# Altium schematic sheet IPMC_MACP 1.SchDoc
size A2
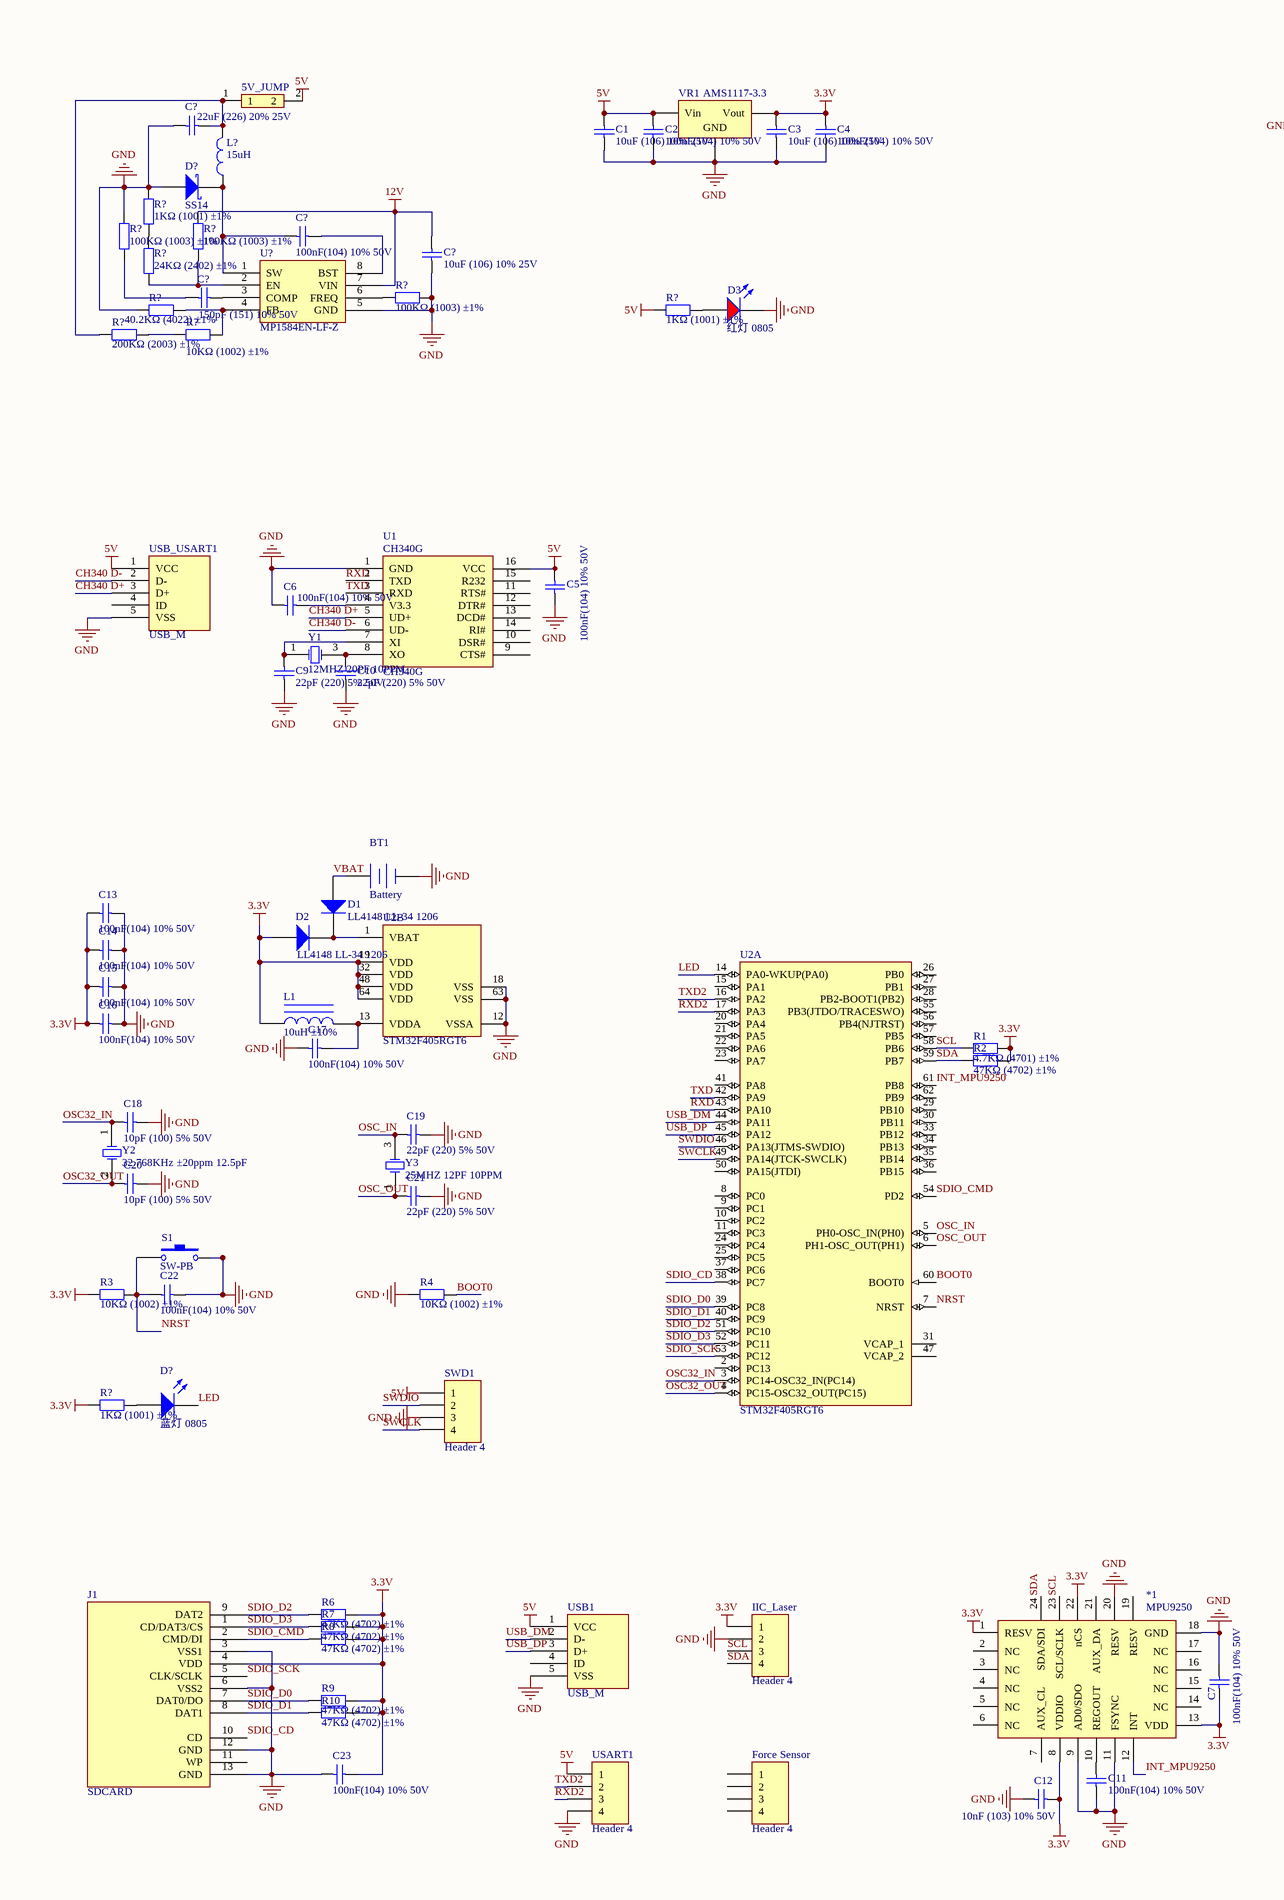
[diagram p0: IPMC_MACP 1.SchDoc, left]
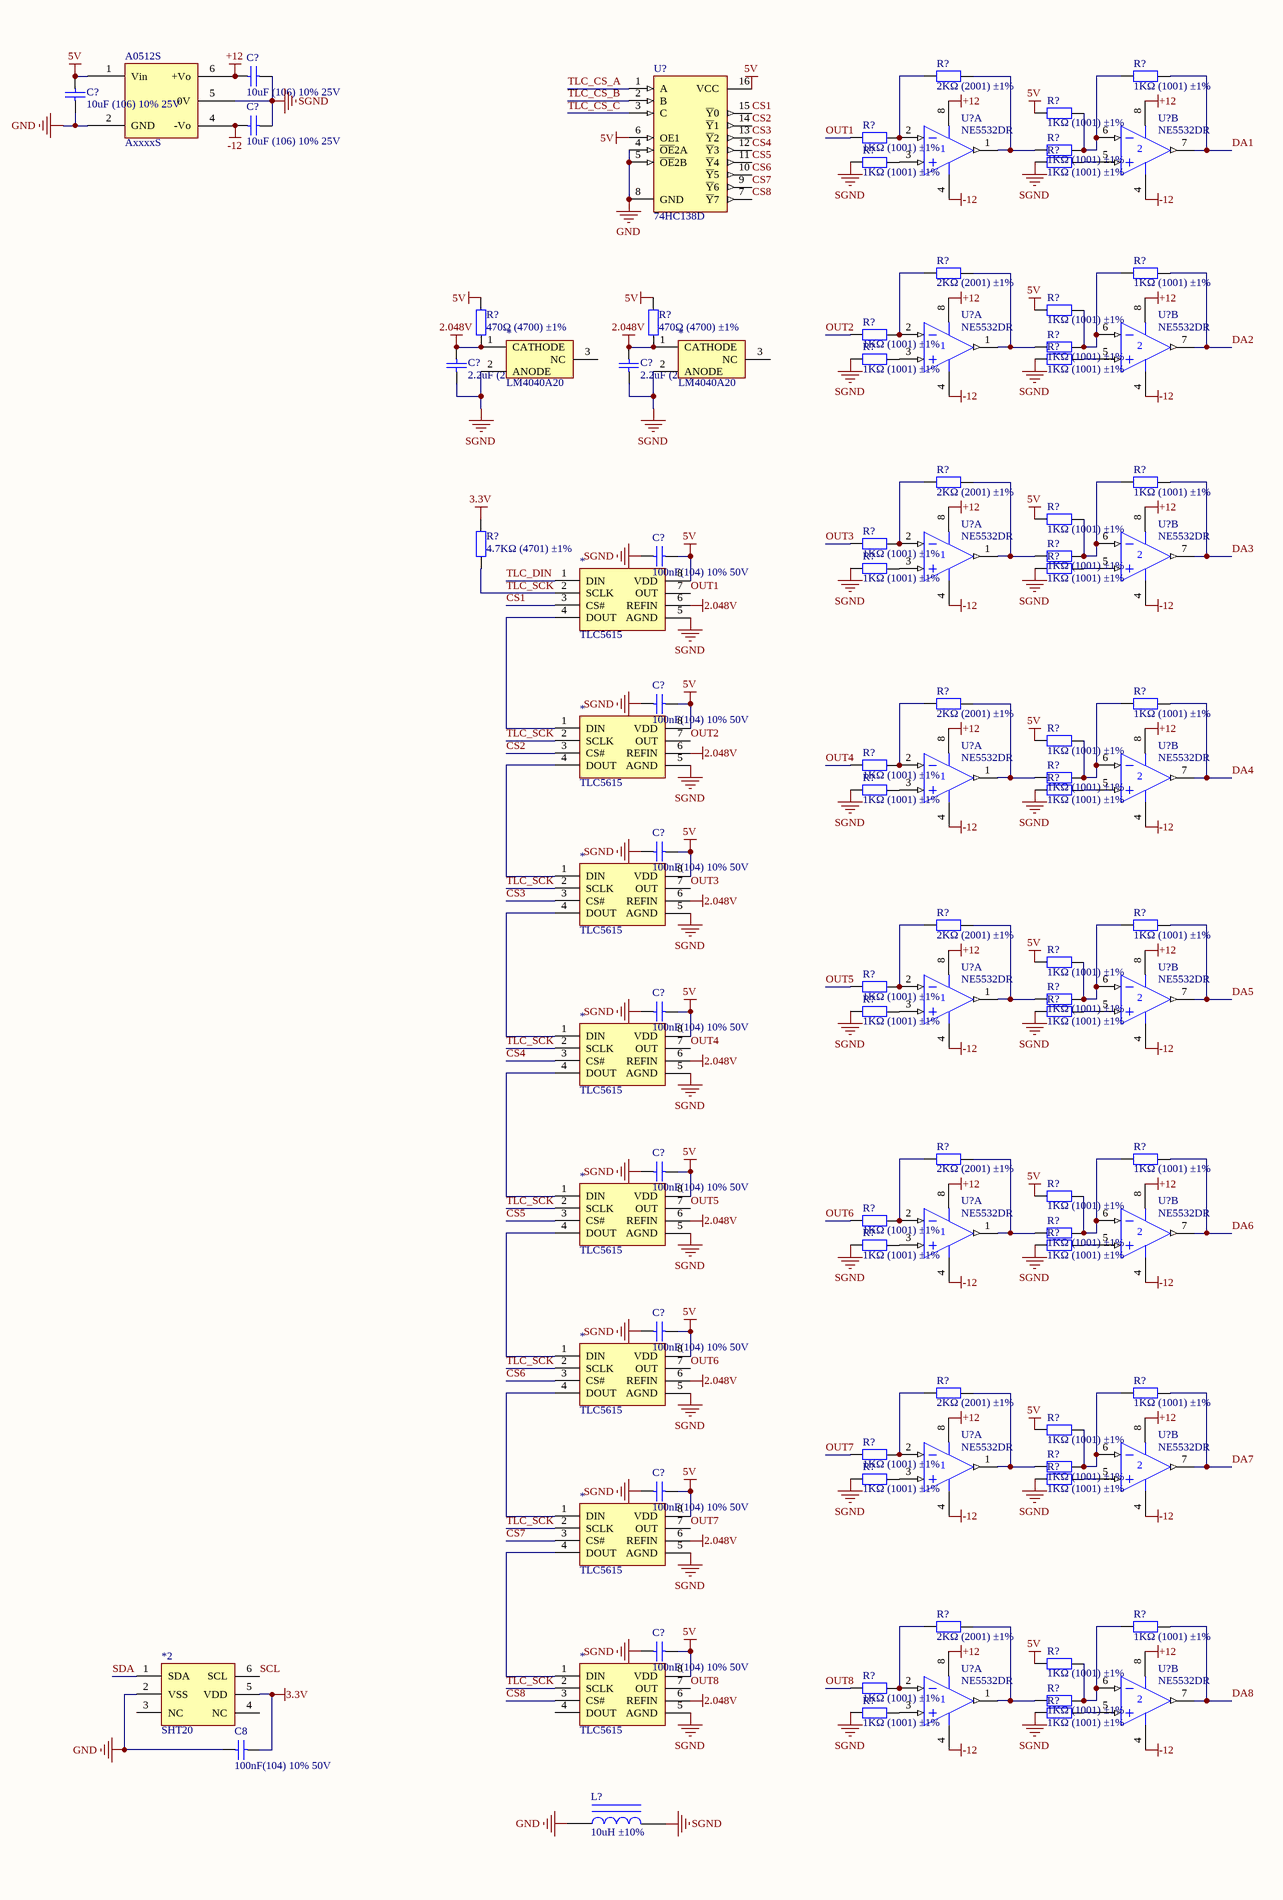
[diagram p1: IPMC_MACP 1.SchDoc, right]

## Parts
(Parts that share a designator on the sheet are numbered #1, #2 ... from top to bottom, then left to right.)
5V_JUMP  Jump  [HDR2X1_A]  (value not drawn)
*1  MPU9250  [QFN24]
*2  SHT20  [DFN6]
*#1  LM4040A20  [SOT-23]
*#2  LM4040A20  [SOT-23]
*#3  TLC5615  [SOP-8]
*#4  TLC5615  [SOP-8]
*#5  TLC5615  [SOP-8]
*#6  TLC5615  [SOP-8]
*#7  TLC5615  [SOP-8]
*#8  TLC5615  [SOP-8]
*#9  TLC5615  [SOP-8]
*#10  TLC5615  [SOP-8]
A0512S  AxxxxS  [AxxxxS]
BT1  Battery  [CR1220]
C1  10uF (106) 10% 25V  [0805_C]
C2  100nF(104) 10% 50V  [0805_C]
C3  10uF (106) 10% 25V  [0805_C]
C4  100nF(104) 10% 50V  [0805_C]
C5  100nF(104) 10% 50V  [0805_C]
C6  100nF(104) 10% 50V  [0805_C]
C7  100nF(104) 10% 50V  [0805_C]
C8  100nF(104) 10% 50V  [0805_C]
C9  22pF (220) 5% 50V  [0805_C]
C10  22pF (220) 5% 50V  [0805_C]
C11  100nF(104) 10% 50V  [0805_C]
C12  10nF (103) 10% 50V  [0805_C]
C13  100nF(104) 10% 50V  [0805_C]
C14  100nF(104) 10% 50V  [0805_C]
C15  100nF(104) 10% 50V  [0805_C]
C16  100nF(104) 10% 50V  [0805_C]
C17  100nF(104) 10% 50V  [0805_C]
C18  10pF (100) 5% 50V  [0805_C]
C19  22pF (220) 5% 50V  [0805_C]
C20  10pF (100) 5% 50V  [0805_C]
C21  22pF (220) 5% 50V  [0805_C]
C22  100nF(104) 10% 50V  [0805_C]
C23  100nF(104) 10% 50V  [0805_C]
C?#1  10uF (106) 10% 25V  [0805_C]
C?#2  22uF (226) 20% 25V  [0805_C]
C?#3  10uF (106) 10% 25V  [0805_C]
C?#4  10uF (106) 10% 25V  [0805_C]
C?#5  10uF (106) 10% 25V  [0805_C]
C?#6  100nF(104) 10% 50V  [0805_C]
C?#7  150pF (151) 10% 50V  [0805_C]
C?#8  2.2uF (225) 20% 50V  [0805_C]
C?#9  2.2uF (225) 20% 50V  [0805_C]
C?#10  100nF(104) 10% 50V  [0805_C]
C?#11  100nF(104) 10% 50V  [0805_C]
C?#12  100nF(104) 10% 50V  [0805_C]
C?#13  100nF(104) 10% 50V  [0805_C]
C?#14  100nF(104) 10% 50V  [0805_C]
C?#15  100nF(104) 10% 50V  [0805_C]
C?#16  100nF(104) 10% 50V  [0805_C]
C?#17  100nF(104) 10% 50V  [0805_C]
D1  LL4148 LL-34 1206  [LL-34]
D2  LL4148 LL-34 1206  [LL-34]
D3  红灯 0805  [0805_LED_S1]
D?#1  Type: SS14  [DIODE-SMA]  (hidden comment: D-Schottky)
D?#2  蓝灯 0805  [0805_LED_S1]
Force_Sensor  Header 4  [HDR1X4]
IIC_Laser  Header 4  [HDR1X4]
J1  SDCARD  [SDCARD_B]
L1  10uH ±10%  [0805_L]
L?#1  15uH  [06030]
L?#2  10uH ±10%  [0805_L]
R1  4.7KΩ (4701) ±1%  [0805_R]
R2  47KΩ (4702) ±1%  [0805_R]
R3  10KΩ (1002) ±1%  [0805_R]
R4  10KΩ (1002) ±1%  [0805_R]
R6  47KΩ (4702) ±1%  [0805_R]
R7  47KΩ (4702) ±1%  [0805_R]
R8  47KΩ (4702) ±1%  [0805_R]
R9  47KΩ (4702) ±1%  [0805_R]
R10  47KΩ (4702) ±1%  [0805_R]
R?#1  2KΩ (2001) ±1%  [0805_R]
R?#2  1KΩ (1001) ±1%  [0805_R]
R?#3  1KΩ (1001) ±1%  [0805_R]
R?#4  1KΩ (1001) ±1%  [0805_R]
R?#5  1KΩ (1001) ±1%  [0805_R]
R?#6  1KΩ (1001) ±1%  [0805_R]
R?#7  1KΩ (1001) ±1%  [0805_R]
R?#8  1KΩ (1001) ±1%  [0805_R]
R?#9  100KΩ (1003) ±1%  [0805_R]
R?#10  100KΩ (1003) ±1%  [0805_R]
R?#11  24KΩ (2402) ±1%  [0805_R]
R?#12  2KΩ (2001) ±1%  [0805_R]
R?#13  1KΩ (1001) ±1%  [0805_R]
R?#14  100KΩ (1003) ±1%  [0805_R]
R?#15  40.2KΩ (4022) ±1%  [0805_R]
R?#16  1KΩ (1001) ±1%  [0805_R]
R?#17  1KΩ (1001) ±1%  [0805_R]
R?#18  470Ω (4700) ±1%  [0805_R]
R?#19  470Ω (4700) ±1%  [0805_R]
R?#20  200KΩ (2003) ±1%  [0805_R]
R?#21  10KΩ (1002) ±1%  [0805_R]
R?#22  1KΩ (1001) ±1%  [0805_R]
R?#23  1KΩ (1001) ±1%  [0805_R]
R?#24  1KΩ (1001) ±1%  [0805_R]
R?#25  1KΩ (1001) ±1%  [0805_R]
R?#26  2KΩ (2001) ±1%  [0805_R]
R?#27  1KΩ (1001) ±1%  [0805_R]
R?#28  1KΩ (1001) ±1%  [0805_R]
R?#29  4.7KΩ (4701) ±1%  [0805_R]
R?#30  1KΩ (1001) ±1%  [0805_R]
R?#31  1KΩ (1001) ±1%  [0805_R]
R?#32  1KΩ (1001) ±1%  [0805_R]
R?#33  1KΩ (1001) ±1%  [0805_R]
R?#34  2KΩ (2001) ±1%  [0805_R]
R?#35  1KΩ (1001) ±1%  [0805_R]
R?#36  1KΩ (1001) ±1%  [0805_R]
R?#37  1KΩ (1001) ±1%  [0805_R]
R?#38  1KΩ (1001) ±1%  [0805_R]
R?#39  1KΩ (1001) ±1%  [0805_R]
R?#40  1KΩ (1001) ±1%  [0805_R]
R?#41  2KΩ (2001) ±1%  [0805_R]
R?#42  1KΩ (1001) ±1%  [0805_R]
R?#43  1KΩ (1001) ±1%  [0805_R]
R?#44  1KΩ (1001) ±1%  [0805_R]
R?#45  1KΩ (1001) ±1%  [0805_R]
R?#46  1KΩ (1001) ±1%  [0805_R]
R?#47  1KΩ (1001) ±1%  [0805_R]
R?#48  2KΩ (2001) ±1%  [0805_R]
R?#49  1KΩ (1001) ±1%  [0805_R]
R?#50  1KΩ (1001) ±1%  [0805_R]
R?#51  1KΩ (1001) ±1%  [0805_R]
R?#52  1KΩ (1001) ±1%  [0805_R]
R?#53  1KΩ (1001) ±1%  [0805_R]
R?#54  1KΩ (1001) ±1%  [0805_R]
R?#55  2KΩ (2001) ±1%  [0805_R]
R?#56  1KΩ (1001) ±1%  [0805_R]
R?#57  1KΩ (1001) ±1%  [0805_R]
R?#58  1KΩ (1001) ±1%  [0805_R]
R?#59  1KΩ (1001) ±1%  [0805_R]
R?#60  1KΩ (1001) ±1%  [0805_R]
R?#61  1KΩ (1001) ±1%  [0805_R]
R?#62  1KΩ (1001) ±1%  [0805_R]
R?#63  2KΩ (2001) ±1%  [0805_R]
R?#64  1KΩ (1001) ±1%  [0805_R]
R?#65  1KΩ (1001) ±1%  [0805_R]
R?#66  1KΩ (1001) ±1%  [0805_R]
R?#67  1KΩ (1001) ±1%  [0805_R]
R?#68  1KΩ (1001) ±1%  [0805_R]
R?#69  1KΩ (1001) ±1%  [0805_R]
S1  SW-PB  [SW_PB2_A1]
SWD1  Header 4  [HDR1X4]
U1  CH340G  [SOIC-16_150mil]
U2  STM32F405RGT6  [STM-LQFP64_L]  (parts A,B of 2)
U?#1  74HC138D  [SOIC-16_150mil]
U?#2  NE5532DR  [SOIC-8_150mil]  (part A of 2)
U?#3  NE5532DR  [SOIC-8_150mil]  (part B of 2)
U?#4  MP1584EN-LF-Z  [SOIC-8_EP_150mil]
U?#5  NE5532DR  [SOIC-8_150mil]  (part A of 2)
U?#6  NE5532DR  [SOIC-8_150mil]  (part B of 2)
U?#7  NE5532DR  [SOIC-8_150mil]  (part A of 2)
U?#8  NE5532DR  [SOIC-8_150mil]  (part B of 2)
U?#9  NE5532DR  [SOIC-8_150mil]  (part A of 2)
U?#10  NE5532DR  [SOIC-8_150mil]  (part B of 2)
U?#11  NE5532DR  [SOIC-8_150mil]  (part A of 2)
U?#12  NE5532DR  [SOIC-8_150mil]  (part B of 2)
U?#13  NE5532DR  [SOIC-8_150mil]  (part A of 2)
U?#14  NE5532DR  [SOIC-8_150mil]  (part B of 2)
U?#15  NE5532DR  [SOIC-8_150mil]  (part A of 2)
U?#16  NE5532DR  [SOIC-8_150mil]  (part B of 2)
U?#17  NE5532DR  [SOIC-8_150mil]  (part A of 2)
U?#18  NE5532DR  [SOIC-8_150mil]  (part B of 2)
USART1  Header 4  [HDR1X4]
USB1  USB_M  [USB_MICRO]
USB_USART1  USB_M  [USB_MICRO]
VR1  AMS1117-3.3  [SOT-223]
Y1  12MHZ 20PF 10PPM  [SMD-3225_4P]
Y2  32.768KHz ±20ppm 12.5pF  [SMD-3215_2P FC - 135]
Y3  25MHZ 12PF 10PPM  [SMD-3225_4P]

## Nets
2.048V: *#1.1(CATHODE) *#2.1(CATHODE) *#3.6(REFIN) *#4.6(REFIN) *#5.6(REFIN) *#6.6(REFIN) *#7.6(REFIN) *#8.6(REFIN) *#9.6(REFIN) *#10.6(REFIN) C?#8.2 C?#9.2 R?#18.1 R?#19.1
3.3V: *1.1(RESV) *1.8(VDDIO) *1.13(VDD) *1.22(nCS) *2.5(VDD) C3.2 C4.2 C7.1 C8.2 C12.1 C13.2 C14.2 C15.2 C16.2 C23.2 D2.1(A) IIC_Laser.1 J1.4(VDD) L1.1 R1.2 R2.2 R3.1 R6.2 R7.2 R8.2 R9.2 R10.2 R?#29.2 R?#57.1 U2.19(VDD) U2.32(VDD) U2.48(VDD) U2.64(VDD) VR1.2(Vout)
5V: 5V_JUMP.2 *#3.8(VDD) *#4.8(VDD) *#5.8(VDD) *#6.8(VDD) *#7.8(VDD) *#8.8(VDD) *#9.8(VDD) *#10.8(VDD) A0512S.1(Vin) C1.2 C2.2 C5.2 C?#4.2 C?#10.1 C?#11.1 C?#12.1 C?#13.1 C?#14.1 C?#15.1 C?#16.1 C?#17.1 R?#3.2 R?#16.1 R?#17.2 R?#18.2 R?#19.2 R?#28.2 R?#36.2 R?#43.2 R?#50.2 R?#58.2 R?#65.2 SWD1.1 U1.16(VCC) U?#1.6(OE1) U?#1.16(VCC) USART1.1 USB1.1(VCC) USB_USART1.1(VCC) VR1.3(Vin)
12V: C?#5.1 R?#10.2 U?#4.7(VIN)
+12: A0512S.6(+Vo) C?#1.1 U?#2.8(V+) U?#3.8(V+) U?#5.8(V+) U?#6.8(V+) U?#7.8(V+) U?#8.8(V+) U?#9.8(V+) U?#10.8(V+) U?#11.8(V+) U?#12.8(V+) U?#13.8(V+) U?#14.8(V+) U?#15.8(V+) U?#16.8(V+) U?#17.8(V+) U?#18.8(V+)
-12: A0512S.4(-Vo) C?#3.1 U?#2.4(V-) U?#3.4(V-) U?#5.4(V-) U?#6.4(V-) U?#7.4(V-) U?#8.4(V-) U?#9.4(V-) U?#10.4(V-) U?#11.4(V-) U?#12.4(V-) U?#13.4(V-) U?#14.4(V-) U?#15.4(V-) U?#16.4(V-) U?#17.4(V-) U?#18.4(V-)
GND: *1.9(AD0/SDO) *1.11(FSYNC) *1.18(GND) *1.20(RESV) *2.2(VSS) A0512S.2(GND) BT1.2(-) C1.1 C2.1 C3.1 C4.1 C5.1 C6.2 C7.2 C8.1 C9.1 C10.1 C11.1 C12.2 C13.1 C14.1 C15.1 C16.1 C17.1 C18.1 C19.1 C20.1 C21.1 C22.2 C23.1 C?#2.1 C?#4.1 C?#5.2 D3.K D?#1.1(A) IIC_Laser.2 J1.3(VSS1) J1.6(VSS2) J1.12(GND) J1.13(GND) L?#2.1 R4.2 R?#8.1 R?#9.2 R?#14.2 R?#15.2 S1.2 SWD1.3 U1.1(GND) U2.12(VSSA) U2.18(VSS) U2.63(VSS) U?#1.4(~{OE}2A) U?#1.5(~{OE}2B) U?#1.8(GND) U?#4.5(GND) USART1.4 USB1.5(VSS) USB_USART1.5(VSS) VR1.1(GND)
SGND: *#1.2(ANODE) *#2.2(ANODE) *#3.5(AGND) *#4.5(AGND) *#5.5(AGND) *#6.5(AGND) *#7.5(AGND) *#8.5(AGND) *#9.5(AGND) *#10.5(AGND) A0512S.5(0V) C?#1.2 C?#3.2 C?#8.1 C?#9.1 C?#10.2 C?#11.2 C?#12.2 C?#13.2 C?#14.2 C?#15.2 C?#16.2 C?#17.2 L?#2.2 R?#6.2 R?#7.2 R?#24.2 R?#25.2 R?#32.2 R?#33.2 R?#39.2 R?#40.2 R?#46.2 R?#47.2 R?#53.2 R?#54.2 R?#61.2 R?#62.2 R?#68.2 R?#69.2
BOOT0: R4.1 U2.60(BOOT0)
CH340 D+: U1.5(UD+) USB_USART1.3(D+)
CH340 D-: U1.6(UD-) USB_USART1.2(D-)
CS1: *#3.3(CS#) U?#1.15(~{Y}0)
CS2: *#4.3(CS#) U?#1.14(~{Y}1)
CS3: *#5.3(CS#) U?#1.13(~{Y}2)
CS4: *#6.3(CS#) U?#1.12(~{Y}3)
CS5: *#7.3(CS#) U?#1.11(~{Y}4)
CS6: *#8.3(CS#) U?#1.10(~{Y}5)
CS7: *#9.3(CS#) U?#1.9(~{Y}6)
CS8: *#10.3(CS#) U?#1.7(~{Y}7)
DA1: R?#2.1 U?#3.7(OUT)
DA2: R?#13.1 U?#6.7(OUT)
DA3: R?#27.1 U?#8.7(OUT)
DA4: R?#35.1 U?#10.7(OUT)
DA5: R?#42.1 U?#12.7(OUT)
DA6: R?#49.1 U?#14.7(OUT)
DA7: R?#56.1 U?#16.7(OUT)
DA8: R?#64.1 U?#18.7(OUT)
INT_MPU9250: *1.12(INT) U2.61(PB8)
LED: D?#2.K U2.14(PA0-WKUP(PA0))
NRST: C22.1 R3.2 S1.1 U2.7(NRST)
OSC32_IN: C18.2 U2.3(PC14-OSC32_IN(PC14)) Y2.1(OSC1)
OSC32_OUT: C20.2 U2.4(PC15-OSC32_OUT(PC15)) Y2.2(OSC2)
OSC_IN: C19.2 U2.5(PH0-OSC_IN(PH0)) Y3.3(OSC2)
OSC_OUT: C21.2 U2.6(PH1-OSC_OUT(PH1)) Y3.1(OSC1)
OUT1: *#3.7(OUT) R?#4.2
OUT2: *#4.7(OUT) R?#22.2
OUT3: *#5.7(OUT) R?#30.2
OUT4: *#6.7(OUT) R?#37.2
OUT5: *#7.7(OUT) R?#44.2
OUT6: *#8.7(OUT) R?#51.2
OUT7: *#9.7(OUT) R?#59.2
OUT8: *#10.7(OUT) R?#66.2
RXD: U1.2(TXD) U2.43(PA10)
RXD2: U2.17(PA3) USART1.3
SCL: *1.23(SCL/SCLK) *2.6(SCL) IIC_Laser.3 R1.1 U2.58(PB6)
SDA: *1.24(SDA/SDI) *2.1(SDA) IIC_Laser.4 R2.1 U2.59(PB7)
SDIO_CD: J1.10(CD) U2.38(PC7)
SDIO_CMD: J1.2(CMD/DI) R8.1 U2.54(PD2)
SDIO_D0: J1.7(DAT0/DO) R9.1 U2.39(PC8)
SDIO_D1: J1.8(DAT1) R10.1 U2.40(PC9)
SDIO_D2: J1.9(DAT2) R6.1 U2.51(PC10)
SDIO_D3: J1.1(CD/DAT3/CS) R7.1 U2.52(PC11)
SDIO_SCK: J1.5(CLK/SCLK) U2.53(PC12)
SWCLK: SWD1.4 U2.49(PA14(JTCK-SWCLK))
SWDIO: SWD1.2 U2.46(PA13(JTMS-SWDIO))
TLC_CS_A: U?#1.1(A)
TLC_CS_B: U?#1.2(B)
TLC_CS_C: U?#1.3(C)
TLC_DIN: *#3.1(DIN)
TLC_SCK: *#3.2(SCLK) *#4.2(SCLK) *#5.2(SCLK) *#6.2(SCLK) *#7.2(SCLK) *#8.2(SCLK) *#9.2(SCLK) *#10.2(SCLK) R?#29.1
TXD: U1.3(RXD) U2.42(PA9)
TXD2: U2.16(PA2) USART1.2
USB_DM: U2.44(PA11) USB1.2(D-)
USB_DP: U2.45(PA12) USB1.3(D+)
VBAT: BT1.1(+) D1.1(A)
Net5V_JUMP_1: 5V_JUMP.1 C?#2.2 L?#1.2 R?#20.1
Net*1_10: *1.10(REGOUT) C11.2
Net*#3_4: *#3.4(DOUT) *#4.1(DIN)
Net*#4_4: *#4.4(DOUT) *#5.1(DIN)
Net*#5_4: *#5.4(DOUT) *#6.1(DIN)
Net*#6_4: *#6.4(DOUT) *#7.1(DIN)
Net*#7_4: *#7.4(DOUT) *#8.1(DIN)
Net*#8_4: *#8.4(DOUT) *#9.1(DIN)
Net*#9_4: *#9.4(DOUT) *#10.1(DIN)
NetC6_1: C6.1 U1.4(V3.3)
NetC9_2: C9.2 U1.7(XI) Y1.1(OSC1)
NetC10_2: C10.2 U1.8(XO) Y1.3(OSC2)
NetC17_2: C17.2 L1.2 U2.13(VDDA)
NetC?#6_1: C?#6.1 D?#1.2(K) L?#1.1 U?#4.1(SW)
NetC?#6_2: C?#6.2 U?#4.8(BST)
NetC?#7_1: C?#7.1 R?#9.1
NetC?#7_2: C?#7.2 U?#4.3(COMP)
NetD1_2: D1.2(K) D2.2(K) U2.1(VBAT)
NetD3_A: D3.A R?#16.2
NetD?#2_A: D?#2.A R?#57.2
NetR?#1_1: R?#1.1 R?#4.1 U?#2.2(IN-)
NetR?#1_2: R?#1.2 R?#5.2 U?#2.1(OUT)
NetR?#2_2: R?#2.2 R?#3.1 R?#5.1 U?#3.6(IN-)
NetR?#6_1: R?#6.1 U?#2.3(IN+)
NetR?#7_1: R?#7.1 U?#3.5(IN+)
NetR?#8_2: R?#8.2 R?#11.1
NetR?#10_1: R?#10.1 R?#11.2 U?#4.2(EN)
NetR?#12_1: R?#12.1 R?#22.1 U?#5.2(IN-)
NetR?#12_2: R?#12.2 R?#23.2 U?#5.1(OUT)
NetR?#13_2: R?#13.2 R?#17.1 R?#23.1 U?#6.6(IN-)
NetR?#14_1: R?#14.1 U?#4.6(FREQ)
NetR?#15_1: R?#15.1 R?#21.2 U?#4.4(FB)
NetR?#20_2: R?#20.2 R?#21.1
NetR?#24_1: R?#24.1 U?#5.3(IN+)
NetR?#25_1: R?#25.1 U?#6.5(IN+)
NetR?#26_1: R?#26.1 R?#30.1 U?#7.2(IN-)
NetR?#26_2: R?#26.2 R?#31.2 U?#7.1(OUT)
NetR?#27_2: R?#27.2 R?#28.1 R?#31.1 U?#8.6(IN-)
NetR?#32_1: R?#32.1 U?#7.3(IN+)
NetR?#33_1: R?#33.1 U?#8.5(IN+)
NetR?#34_1: R?#34.1 R?#37.1 U?#9.2(IN-)
NetR?#34_2: R?#34.2 R?#38.2 U?#9.1(OUT)
NetR?#35_2: R?#35.2 R?#36.1 R?#38.1 U?#10.6(IN-)
NetR?#39_1: R?#39.1 U?#9.3(IN+)
NetR?#40_1: R?#40.1 U?#10.5(IN+)
NetR?#41_1: R?#41.1 R?#44.1 U?#11.2(IN-)
NetR?#41_2: R?#41.2 R?#45.2 U?#11.1(OUT)
NetR?#42_2: R?#42.2 R?#43.1 R?#45.1 U?#12.6(IN-)
NetR?#46_1: R?#46.1 U?#11.3(IN+)
NetR?#47_1: R?#47.1 U?#12.5(IN+)
NetR?#48_1: R?#48.1 R?#51.1 U?#13.2(IN-)
NetR?#48_2: R?#48.2 R?#52.2 U?#13.1(OUT)
NetR?#49_2: R?#49.2 R?#50.1 R?#52.1 U?#14.6(IN-)
NetR?#53_1: R?#53.1 U?#13.3(IN+)
NetR?#54_1: R?#54.1 U?#14.5(IN+)
NetR?#55_1: R?#55.1 R?#59.1 U?#15.2(IN-)
NetR?#55_2: R?#55.2 R?#60.2 U?#15.1(OUT)
NetR?#56_2: R?#56.2 R?#58.1 R?#60.1 U?#16.6(IN-)
NetR?#61_1: R?#61.1 U?#15.3(IN+)
NetR?#62_1: R?#62.1 U?#16.5(IN+)
NetR?#63_1: R?#63.1 R?#66.1 U?#17.2(IN-)
NetR?#63_2: R?#63.2 R?#67.2 U?#17.1(OUT)
NetR?#64_2: R?#64.2 R?#65.1 R?#67.1 U?#18.6(IN-)
NetR?#68_1: R?#68.1 U?#17.3(IN+)
NetR?#69_1: R?#69.1 U?#18.5(IN+)

Not connected (* = marked no-connect by the designer): *1 2(NC) 3(NC) 4(NC) 5(NC) 6(NC) 7(AUX_CL) 14(NC) 15(NC) 16(NC) 17(NC) 19(RESV) 21(AUX_DA); *2 3(NC) 4(NC); *#1 3(NC); *#2 3(NC); *#10 4(DOUT); Force_Sensor 1 2 3 4; J1 11(WP); U1 9(CTS#) 10(DSR#) 11(RTS#) 12(DTR#) 13(DCD#) 14(RI#) 15(R232); U2 2(PC13) 8(PC0) 9(PC1) 10(PC2) 11(PC3) 15(PA1) 20(PA4) 21(PA5) 22(PA6) 23(PA7) 24(PC4) 25(PC5) 26(PB0) 27(PB1) 28(PB2-BOOT1(PB2)) 29(PB10) 30(PB11) 31(VCAP_1) 33(PB12) 34(PB13) 35(PB14) 36(PB15) 37(PC6) 41(PA8) 47(VCAP_2) 50(PA15(JTDI)) 55(PB3(JTDO/TRACESWO)) 56(PB4(NJTRST)) 57(PB5) 62(PB9); USB1 4(ID); USB_USART1 4(ID)

## Library data of the parts
5V_JUMP = Jump: 跳帽
*#1 *#2 = LM4040A20: 2.048V基准电压芯片
*#3-*#10 = TLC5615: 单通道10bitDA数模转换器
A0512S = AxxxxS: 能达电源模块
BT1 = Battery: 备份电池; Published: 24-Mar-1999; LatestRevisionDate: 17-Jul-2002; LatestRevisionNote: Re-released for DXP Platform.; PackageReference: BAT-2; Publisher: Altium Limited
C1 C3 C?#1 C?#3-C?#5 = 0805 10uF (106) 10% 25V: 贴片电容; ComponentLink1Description: 供应商链接; ComponentLink1URL: http://www.szlcsc.com/product/details_16532.html; Package: 0805; Supplier: LC; SuppliersPartNumber: C15850
C2 C4-C8 C11 C13-C17 C22 C23 C?#6 C?#10-C?#17 = 0805 100nF(104) 10% 50V: 贴片电容; ComponentLink1Description: 供应商链接; ComponentLink1URL: http://www.szlcsc.com/product/details_50686.html; Package: 0805; Supplier: LC; SuppliersPartNumber: C49678
C9 C10 C19 C21 = 0805 22pF (220) 5% 50V: 贴片电容; ComponentLink1Description: 供应商链接; ComponentLink1URL: http://www.szlcsc.com/product/details_2156.html; Package: 0805; Supplier: LC; SuppliersPartNumber: C1804
C12 = 0805 10nF (103) 10% 50V: 贴片电容; ComponentLink1Description: 供应商链接; ComponentLink1URL: http://www.szlcsc.com/product/details_2062.html; Package: 0805; Supplier: LC; SuppliersPartNumber: C1710
C18 C20 = 0805 10pF (100) 5% 50V: 贴片电容; ComponentLink1Description: 供应商链接; ComponentLink1URL: http://www.szlcsc.com/product/details_2137.html; Package: 0805; Supplier: LC; SuppliersPartNumber: C1785
C?#2 = 0805 22uF (226) 20% 25V: 贴片电容; ComponentLink1Description: 供应商链接; ComponentLink1URL: http://www.szlcsc.com/product/details_46786.html; Package: 0805; Supplier: LC; SuppliersPartNumber: C45783
C?#7 = 0805 150pF (151) 10% 50V: 贴片电容; ComponentLink1Description: 供应商链接; ComponentLink1URL: http://www.szlcsc.com/product/details_2068.html; Package: 0805; Supplier: LC; SuppliersPartNumber: C1716
C?#8 C?#9 = 0805 2.2uF (225) 20% 50V: 贴片电容; ComponentLink1Description: 供应商链接; ComponentLink1URL: http://www.szlcsc.com/product/details_50225.html; Package: 0805; Supplier: LC; SuppliersPartNumber: C49217
D1 D2 = LL-34 LL4148 LL-34 1206: 开关二极管; ComponentLink1Description: 供应商链接; ComponentLink1URL: http://www.szlcsc.com/product/details_10338.html; Package: LL-34; Supplier: LC; SuppliersPartNumber: C9808
D3 = 0805 红灯: 发光二极管; ComponentLink1Description: 供应商链接; ComponentLink1URL: http://www.szlcsc.com/product/details_2668.html; Package: 0805; Supplier: LC; SuppliersPartNumber: C2295
D?#1 = D-Schottky: 肖特基二极管; Published: 8-Jun-2000; LatestRevisionDate: 17-Jul-2002; LatestRevisionNote: Re-released for DXP Platform.; PackageReference: SMB; Publisher: Altium Limited; Code_JEDEC: DO-214-AA
D?#2 = 0805 蓝灯: 发光二极管; ComponentLink1Description: 供应商链接; ComponentLink1URL: http://www.szlcsc.com/product/details_2666.html; Package: 0805; Supplier: LC; SuppliersPartNumber: C2293
Force_Sensor IIC_Laser SWD1 USART1 = Header 4: Header, 4-Pin; LatestRevisionDate: 17-Jul-2002; LatestRevisionNote: Re-released for DXP Platform.; Publisher: Altium Limited
J1 = SDCARD: SD卡自弹
L1 L?#2 = 0805 10uH 10%: 贴片电感; ComponentLink1Description: 供应商链接; ComponentLink1URL: http://www.szlcsc.com/product/details_1398.html; Package: 0805; Supplier: LC; SuppliersPartNumber: C1046
L?#1 = Inductor: 电感; Code_IEC: 1005; Published: 8-Jun-2000; LatestRevisionDate: 17-Jul-2002; LatestRevisionNote: Re-released for DXP Platform.; PackageReference: 0402-A; Publisher: Altium Limited; Code_JEITA: 0402
R1 R?#29 = 0805 4.7KΩ (4701) 1%: 贴片电阻; ComponentLink1Description: 供应商链接; ComponentLink1URL: http://www.szlcsc.com/product/details_18361.html; Package: 0805; Supplier: LC; SuppliersPartNumber: C17673
R2 R6-R10 = 0805 47KΩ (4702) 1%: 贴片电阻; ComponentLink1Description: 供应商链接; ComponentLink1URL: http://www.szlcsc.com/product/details_18401.html; Package: 0805; Supplier: LC; SuppliersPartNumber: C17713
R3 R4 R?#21 = 0805 10KΩ (1002) 1%: 贴片电阻; ComponentLink1Description: 供应商链接; ComponentLink1URL: http://www.szlcsc.com/product/details_18102.html; Package: 0805; Supplier: LC; SuppliersPartNumber: C17414
R?#1 R?#12 R?#26 R?#34 R?#41 R?#48 R?#55 R?#63 = 0805 2KΩ (2001) 1%: 贴片电阻; ComponentLink1Description: 供应商链接; ComponentLink1URL: http://www.szlcsc.com/product/details_18292.html; Package: 0805; Supplier: LC; SuppliersPartNumber: C17604
R?#2-R?#8 R?#13 R?#16 R?#17 R?#22-R?#25 R?#27 R?#28 R?#30-R?#33 R?#35-R?#40 R?#42-R?#47 R?#49-R?#54 R?#56-R?#62 R?#64-R?#69 = 0805 1KΩ (1001) 1%: 贴片电阻; ComponentLink1Description: 供应商链接; ComponentLink1URL: http://www.szlcsc.com/product/details_18201.html; Package: 0805; Supplier: LC; SuppliersPartNumber: C17513
R?#9 R?#10 R?#14 = 0805 100KΩ (1003) 1%: 贴片电阻; ComponentLink1Description: 供应商链接; ComponentLink1URL: http://www.szlcsc.com/product/details_18095.html; Package: 0805; Supplier: LC; SuppliersPartNumber: C17407
R?#11 = 0805 24KΩ (2402) 1%: 贴片电阻; ComponentLink1Description: 供应商链接; ComponentLink1URL: http://www.szlcsc.com/product/details_18263.html; Package: 0805; Supplier: LC; SuppliersPartNumber: C17575
R?#15 = 0805 40.2KΩ (4022) 1%: 贴片电阻; ComponentLink1Description: 供应商链接; ComponentLink1URL: http://www.szlcsc.com/product/details_18366.html; Package: 0805; Supplier: LC; SuppliersPartNumber: C17678
R?#18 R?#19 = 0805 470Ω (4700) 1%: 贴片电阻; ComponentLink1Description: 供应商链接; ComponentLink1URL: http://www.szlcsc.com/product/details_18398.html; Package: 0805; Supplier: LC; SuppliersPartNumber: C17710
R?#20 = 0805 200KΩ (2003) 1%: 贴片电阻; ComponentLink1Description: 供应商链接; ComponentLink1URL: http://www.szlcsc.com/product/details_18227.html; Package: 0805; Supplier: LC; SuppliersPartNumber: C17539
S1 = SW-PB: 微动开关; Published: 24-Mar-1999; LatestRevisionDate: 17-Jul-2002; LatestRevisionNote: Re-released for DXP Platform.; PackageReference: SPST-2; Publisher: Altium Limited
U1 = CH340G: USB; ComponentLink1Description: 供应商链接; ComponentLink1URL: http://www.szlcsc.com/product/details_14927.html; Package: SOIC-16_150mil; Supplier: LC; SuppliersPartNumber: C14267
U2 = STM32F405RGT6: ARM Cortex-M4 32-bit MCU+FPU, 210 DMIPS, 1024 kB Flash, 192 kB Internal RAM, 51 I/Os, 64-pin LQFP, -40 to 85 degC, Tray; Manufacturer: STMicroelectronics; D/A Converter: 2x12-bit; FLASH Size (Prog) (kB): 1024; I/Os (High Current): 51; Internal RAM Size (kB): 192; Operating Frequency(F) (Processor speed) (MHz): 168; Supply Voltage(Vcc) max (V): 3.6; Supply Voltage(Vcc) min (V): 1.8; DatasheetVersion: Rev. 4; PackageVersion: Rev. 4, 06/2013; PackageReference: LQFP64; PackageDescription: 64-Pin Low Profile Quad Flat Package, 10 x 10 mm Body, 0.5 mm Pitch; Supplier 1: Digi-Key; Supplier Part Number 1: 497-11767-ND; Supplier 2: Farnell; Supplier Part Number 2: 2064363; Supplier 3: Newark; Supplier Part Number 3: 73T2329; Supplier 4: Mouser; Supplier Part Number 4: 511-STM32F405RGT6; Core: ARM Cortex-M4; Packing: Tray; Mounting Technology: Surface Mount; PartNumber: STM32F405RGT6; ComponentLink1Description: Manufacturer URL; ComponentLink1URL: http://www.st.com/web/en/home.html; ComponentLink2Description: Datasheet; ComponentLink2URL: http://www.st.com/st-web-ui/static/active/en/resource/technical/document/datasheet/DM00037051.pdf; ComponentLink3Description: Package Specification; ComponentLink3URL: http://www.st.com/st-web-ui/static/active/en/resource/technical/document/datasheet/DM00037051.pdf
U?#1 = 74HC138D: 74系列逻辑芯片; ComponentLink1Description: 供应商链接; ComponentLink1URL: http://www.szlcsc.com/product/details_6053.html; Package: SOIC-16_150mil; Supplier: LC; SuppliersPartNumber: C5602
U?#2 U?#3 U?#5-U?#18 = NE5532DR: 功放; ComponentLink1Description: 供应商链接; ComponentLink1URL: http://www.szlcsc.com/product/details_7903.html; Package: SOIC-8_150mil; Supplier: LC; SuppliersPartNumber: C7426
U?#4 = MP1584EN-LF-Z: DC-DC芯片; ComponentLink1Description: 供应商链接; ComponentLink1URL: http://www.szlcsc.com/product/details_15724.html; Package: SOIC-8_EP_150mil; Supplier: LC; SuppliersPartNumber: C15051
USB1 USB_USART1 = USB_M: MicroUSB接口
VR1 = SOT-223 AMS1117-3.3: 低压差线性稳压(LDO); ComponentLink1Description: 供应商链接; ComponentLink1URL: http://www.szlcsc.com/product/details_6652.html; Package: SOT-223; Supplier: LC; SuppliersPartNumber: C6186
Y1 = SMD-3225_4P  12MHZ 20PF 10PPM: 贴片晶振; ComponentLink1Description: 供应商链接; ComponentLink1URL: http://www.szlcsc.com/product/details_9522.html; Package: SMD-3225_4P; Supplier: LC; SuppliersPartNumber: C9002
Y2 = SMD-3215_2P 32.768KHz 20ppm 12.5pF: 贴片晶振; ComponentLink1Description: 供应商链接; ComponentLink1URL: http://www.szlcsc.com/product/details_33310.html; Package: SMD-3215_2P; Supplier: LC; SuppliersPartNumber: C32346
Y3 = SMD-3225_4P  25MHZ 12PF 10PPM: 贴片晶振; ComponentLink1Description: 供应商链接; ComponentLink1URL: http://www.szlcsc.com/product/details_9526.html; Package: SMD-3225_4P; Supplier: LC; SuppliersPartNumber: C9006